# Altium schematic sheet 10B_WRAPPER.SchDoc
size 420 x 297 mm
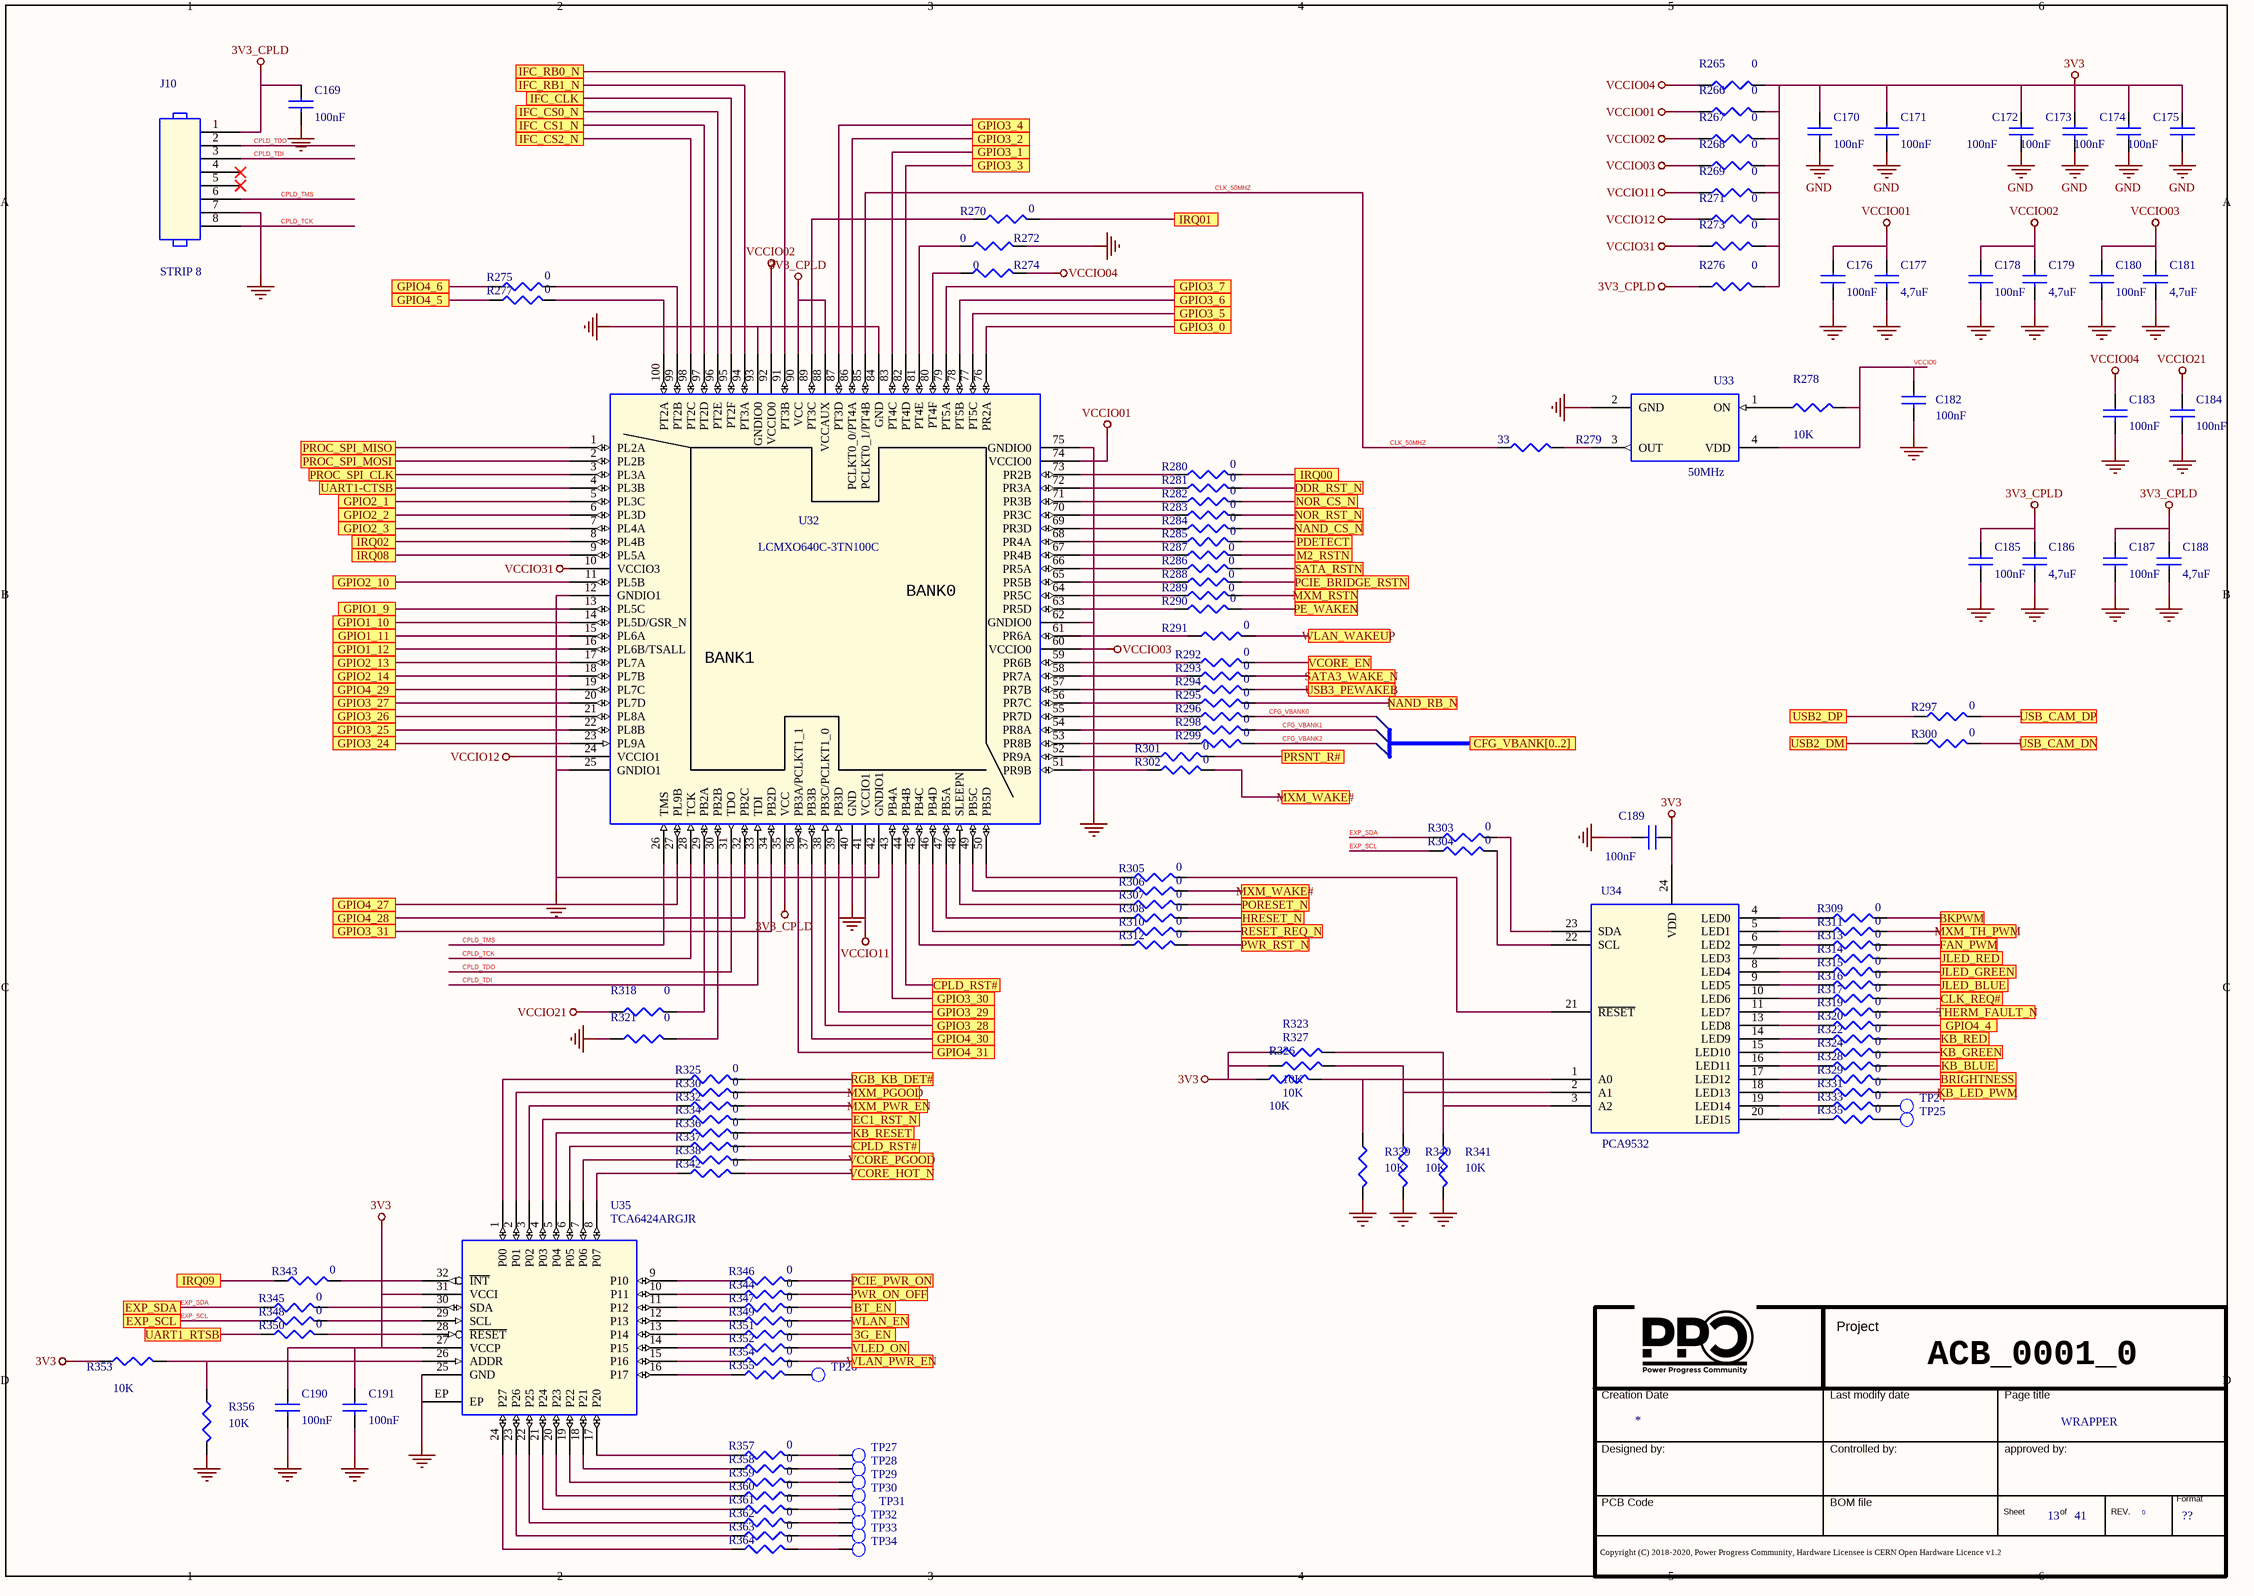
[diagram p0: 10B_WRAPPER.SchDoc]

## Parts
*  Doc: WRAPPER  Page Count: 41  Page Number: 13  Page Size: ??  RevCode: 0  (hidden comment: Title_block_PPC)  (graphical)
C169  100nF  [SMD_0402]
C170  100nF  [SMD_0402]
C171  100nF  [SMD_0402]
C172  100nF  [SMD_0402]
C173  100nF  [SMD_0402]
C174  100nF  [SMD_0402]
C175  100nF  [SMD_0402]
C176  100nF  [SMD_0402]
C177  4,7uF  [SMD_0603]
C178  100nF  [SMD_0402]
C179  4,7uF  [SMD_0603]
C180  100nF  [SMD_0402]
C181  4,7uF  [SMD_0603]
C182  100nF  [SMD_0402]
C183  100nF  [SMD_0402]
C184  100nF  [SMD_0402]
C185  100nF  [SMD_0402]
C186  4,7uF  [SMD_0603]
C187  100nF  [SMD_0402]
C188  4,7uF  [SMD_0603]
C189  100nF  [SMD_0402]
C190  100nF  [SMD_0402]
C191  100nF  [SMD_0402]
J10  STRIP 8  [PTH]
R265  0  [SMD_0402]
R266  0  [SMD_0402]
R267  0  [SMD_0402]
R268  0  [SMD_0402]
R269  0  [SMD_0402]
R270  0  [SMD_0402]
R271  0  [SMD_0402]
R272  0  [SMD_0402]
R273  0  [SMD_0402]
R274  0  [SMD_0402]
R275  0  [SMD_0402]
R276  0  [SMD_0402]
R277  0  [SMD_0402]
R278  10K  [SMD_0402]
R279  33  [SMD_0402]
R280  0  [SMD_0402]
R281  0  [SMD_0402]
R282  0  [SMD_0402]
R283  0  [SMD_0402]
R284  0  [SMD_0402]
R285  0  [SMD_0402]
R286  0  [SMD_0402]
R287  0  [SMD_0402]
R288  0  [SMD_0402]
R289  0  [SMD_0402]
R290  0  [SMD_0402]
R291  0  [SMD_0402]
R292  0  [SMD_0402]
R293  0  [SMD_0402]
R294  0  [SMD_0402]
R295  0  [SMD_0402]
R296  0  [SMD_0402]
R297  0  [SMD_0402]
R298  0  [SMD_0402]
R299  0  [SMD_0402]
R300  0  [SMD_0402]
R301  0  [SMD_0402]
R302  0  [SMD_0402]
R303  0  [SMD_0402]
R304  0  [SMD_0402]
R305  0  [SMD_0402]
R306  0  [SMD_0402]
R307  0  [SMD_0402]
R308  0  [SMD_0402]
R309  0  [SMD_0402]
R310  0  [SMD_0402]
R311  0  [SMD_0402]
R312  0  [SMD_0402]
R313  0  [SMD_0402]
R314  0  [SMD_0402]
R315  0  [SMD_0402]
R316  0  [SMD_0402]
R317  0  [SMD_0402]
R318  0  [SMD_0402]
R319  0  [SMD_0402]
R320  0  [SMD_0402]
R321  0  [SMD_0402]
R322  0  [SMD_0402]
R323  10K  [SMD_0402]
R324  0  [SMD_0402]
R325  0  [SMD_0402]
R326  10K  [SMD_0402]
R327  10K  [SMD_0402]
R328  0  [SMD_0402]
R329  0  [SMD_0402]
R330  0  [SMD_0402]
R331  0  [SMD_0402]
R332  0  [SMD_0402]
R333  0  [SMD_0402]
R334  0  [SMD_0402]
R335  0  [SMD_0402]
R336  0  [SMD_0402]
R337  0  [SMD_0402]
R338  0  [SMD_0402]
R339  10K  [SMD_0402]
R340  10K  [SMD_0402]
R341  10K  [SMD_0402]
R342  0  [SMD_0402]
R343  0  [SMD_0402]
R344  0  [SMD_0402]
R345  0  [SMD_0402]
R346  0  [SMD_0402]
R347  0  [SMD_0402]
R348  0  [SMD_0402]
R349  0  [SMD_0402]
R350  0  [SMD_0402]
R351  0  [SMD_0402]
R352  0  [SMD_0402]
R353  10K  [SMD_0402]
R354  0  [SMD_0402]
R355  0  [SMD_0402]
R356  10K  [SMD_0402]
R357  0  [SMD_0402]
R358  0  [SMD_0402]
R359  0  [SMD_0402]
R360  0  [SMD_0402]
R361  0  [SMD_0402]
R362  0  [SMD_0402]
R363  0  [SMD_0402]
R364  0  [SMD_0402]
TP24  TEST POINT  [PCB]  (value not drawn)
TP25  TEST POINT  [PCB]  (value not drawn)
TP26  TEST POINT  [PCB]  (value not drawn)
TP27  TEST POINT  [PCB]  (value not drawn)
TP28  TEST POINT  [PCB]  (value not drawn)
TP29  TEST POINT  [PCB]  (value not drawn)
TP30  TEST POINT  [PCB]  (value not drawn)
TP31  TEST POINT  [PCB]  (value not drawn)
TP32  TEST POINT  [PCB]  (value not drawn)
TP33  TEST POINT  [PCB]  (value not drawn)
TP34  TEST POINT  [PCB]  (value not drawn)
U32  LCMXO640C-3TN100C  [TQFP-100]
U33  50MHz  [4 PIN SMT]
U34  PCA9532  [TSSOP24]
U35  TCA6424ARGJR  [QFN32]

## Ports
3G_EN, BKPWM, BRIGHTNESS, BT_EN, CFG_VBANK[0..2], CLK_REQ#, CPLD_RST#, DDR_RST_N, EC1_RST_N, EXP_SCL, EXP_SDA, FAN_PWM, GPIO1_9, GPIO1_10, GPIO1_11, GPIO1_12, GPIO2_1, GPIO2_2, GPIO2_3, GPIO2_10, GPIO2_13, GPIO2_14, GPIO3_0, GPIO3_1, GPIO3_2, GPIO3_3, GPIO3_4, GPIO3_5, GPIO3_6, GPIO3_7, GPIO3_24, GPIO3_25, GPIO3_26, GPIO3_27, GPIO3_28, GPIO3_29, GPIO3_30, GPIO3_31, GPIO4_4, GPIO4_5, GPIO4_6, GPIO4_27, GPIO4_28, GPIO4_29, GPIO4_30, GPIO4_31, HRESET_N, IFC_CLK, IFC_CS0_N, IFC_CS1_N, IFC_CS2_N, IFC_RB0_N, IFC_RB1_N, IRQ00, IRQ01, IRQ02, IRQ08, IRQ09, JLED_BLUE, JLED_GREEN, JLED_RED, KB_BLUE, KB_GREEN, KB_LED_PWM, KB_RED, KB_RESET, M2_RSTN, MXM_PGOOD, MXM_PWR_EN, MXM_RSTN, MXM_TH_PWM, MXM_WAKE#, NAND_CS_N, NAND_RB_N, NOR_CS_N, NOR_RST_N, PCIE_BRIDGE_RSTN, PCIE_PWR_ON, PDETECT, PE_WAKEN, PORESET_N, PROC_SPI_CLK, PROC_SPI_MISO, PROC_SPI_MOSI, PRSNT_R#, PWR_ON_OFF, PWR_RST_N, RESET_REQ_N, RGB_KB_DET#, SATA3_WAKE_N, SATA_RSTN, THERM_FAULT_N, UART1-CTSB, UART1_RTSB, USB2_DM, USB2_DP, USB3_PEWAKEB, USB_CAM_DN, USB_CAM_DP, VCORE_EN, VCORE_HOT_N, VCORE_PGOOD, VLED_ON, WLAN_EN, WLAN_PWR_EN, WLAN_WAKEUP

## Nets
3V3: C170.1 C171.1 C172.1 C173.1 C174.1 C175.1 C189.1 C190.1 C191.1 R265.2 R266.2 R267.2 R268.2 R269.2 R271.2 R273.2 R276.2 R323.1 R326.1 R327.1 R353.1 U34.24(VDD) U35.27(VCCP) U35.31(VCCI)
3V3_CPLD: C169.1 C185.1 C186.1 C187.1 C188.1 J10.1 R276.1 U32.35(VCC) U32.88(VCCAUX) U32.90(VCC)
GND: C170.2 C171.2 C172.2 C173.2 C174.2 C175.2 C182.2 C189.2 C190.2 C191.2 R339.2 R340.2 R341.2 R356.2 U33.2(GND) U35.25(GND) U35.EP
GND_SIGNAL: C169.2 C176.2 C177.2 C178.2 C179.2 C180.2 C181.2 C183.2 C184.2 C185.2 C186.2 C187.2 C188.2 J10.7 R272.1 R321.1 U32.12(GNDIO1) U32.25(GNDIO1) U32.40(GND) U32.42(GNDIO1) U32.62(GNDIO0) U32.75(GNDIO0) U32.84(GND) U32.93(GNDIO0)
VCCIO01: C176.1 C177.1 R266.1 U32.74(VCCIO0)
VCCIO02: C178.1 C179.1 R267.1 U32.92(VCCIO0)
VCCIO03: C180.1 C181.1 R268.1 U32.60(VCCIO0)
VCCIO04: C183.1 R265.1 R274.1
VCCIO11: R269.1 U32.41(VCCIO1)
VCCIO12: R271.1 U32.24(VCCIO1)
VCCIO21: C184.1 R318.1
VCCIO31: R273.1 U32.10(VCCIO3)
3G_EN: R351.2 ; port 3G_EN
BKPWM: R309.2 ; port BKPWM
BRIGHTNESS: R329.2 ; port BRIGHTNESS
BT_EN: R347.2 ; port BT_EN
CFG_VBANK0: R296.2
CFG_VBANK1: R298.2
CFG_VBANK2: R299.2
CLK_50MHZ: R279.2 U32.85(PCLKT0_1/PT4B)
CLK_REQ#: R317.2 ; port CLK_REQ#
CPLD_RST#: R337.2 U32.44(PB4B) ; port CPLD_RST#
CPLD_TCK: J10.8 U32.28(TCK)
CPLD_TDI: J10.3 U32.33(TDI)
CPLD_TDO: J10.2 U32.31(TDO)
CPLD_TMS: J10.6 U32.26(TMS)
DDR_RST_N: R281.2 ; port DDR_RST_N
EC1_RST_N: R334.2 ; port EC1_RST_N
EXP_SCL: R304.1 R348.1 ; port EXP_SCL
EXP_SDA: R303.1 R345.1 ; port EXP_SDA
FAN_PWM: R313.2 ; port FAN_PWM
GPIO1_9: U32.13(PL5C) ; port GPIO1_9
GPIO1_10: U32.14(PL5D/GSR_N) ; port GPIO1_10
GPIO1_11: U32.15(PL6A) ; port GPIO1_11
GPIO1_12: U32.16(PL6B/TSALL) ; port GPIO1_12
GPIO2_1: U32.5(PL3C) ; port GPIO2_1
GPIO2_2: U32.6(PL3D) ; port GPIO2_2
GPIO2_3: U32.7(PL4A) ; port GPIO2_3
GPIO2_10: U32.11(PL5B) ; port GPIO2_10
GPIO2_13: U32.17(PL7A) ; port GPIO2_13
GPIO2_14: U32.18(PL7B) ; port GPIO2_14
GPIO3_0: U32.76(PR2A) ; port GPIO3_0
GPIO3_1: U32.83(PT4C) ; port GPIO3_1
GPIO3_2: U32.86(PCLKT0_0/PT4A) ; port GPIO3_2
GPIO3_3: U32.82(PT4D) ; port GPIO3_3
GPIO3_4: U32.87(PT3D) ; port GPIO3_4
GPIO3_5: U32.77(PT5C) ; port GPIO3_5
GPIO3_6: U32.78(PT5B) ; port GPIO3_6
GPIO3_7: U32.79(PT5A) ; port GPIO3_7
GPIO3_24: U32.23(PL9A) ; port GPIO3_24
GPIO3_25: U32.22(PL8B) ; port GPIO3_25
GPIO3_26: U32.21(PL8A) ; port GPIO3_26
GPIO3_27: U32.20(PL7D) ; port GPIO3_27
GPIO3_28: U32.38(PB3C/PCLKT1_0) ; port GPIO3_28
GPIO3_29: U32.39(PB3D) ; port GPIO3_29
GPIO3_30: U32.43(PB4A) ; port GPIO3_30
GPIO3_31: U32.34(PB2D) ; port GPIO3_31
GPIO4_4: R320.2 ; port GPIO4_4
GPIO4_5: R277.1 ; port GPIO4_5
GPIO4_6: R275.1 ; port GPIO4_6
GPIO4_27: U32.27(PL9B) ; port GPIO4_27
GPIO4_28: U32.32(PB2C) ; port GPIO4_28
GPIO4_29: U32.19(PL7C) ; port GPIO4_29
GPIO4_30: U32.37(PB3B) ; port GPIO4_30
GPIO4_31: U32.36(PB3A/PCLKT1_1) ; port GPIO4_31
HRESET_N: R308.2 ; port HRESET_N
IFC_CLK: U32.95(PT2F) ; port IFC_CLK
IFC_CS0_N: U32.96(PT2E) ; port IFC_CS0_N
IFC_CS1_N: U32.97(PT2D) ; port IFC_CS1_N
IFC_CS2_N: U32.98(PT2C) ; port IFC_CS2_N
IFC_RB0_N: U32.91(PT3B) ; port IFC_RB0_N
IFC_RB1_N: U32.94(PT3A) ; port IFC_RB1_N
IRQ00: R280.2 ; port IRQ00
IRQ01: R270.2 ; port IRQ01
IRQ02: U32.8(PL4B) ; port IRQ02
IRQ08: U32.9(PL5A) ; port IRQ08
IRQ09: R343.1 ; port IRQ09
JLED_BLUE: R316.2 ; port JLED_BLUE
JLED_GREEN: R315.2 ; port JLED_GREEN
JLED_RED: R314.2 ; port JLED_RED
KB_BLUE: R328.2 ; port KB_BLUE
KB_GREEN: R324.2 ; port KB_GREEN
KB_LED_PWM: R331.2 ; port KB_LED_PWM
KB_RED: R322.2 ; port KB_RED
KB_RESET: R336.2 ; port KB_RESET
M2_RSTN: R287.2 ; port M2_RSTN
MXM_PGOOD: R330.2 ; port MXM_PGOOD
MXM_PWR_EN: R332.2 ; port MXM_PWR_EN
MXM_RSTN: R289.2 ; port MXM_RSTN
MXM_TH_PWM: R311.2 ; port MXM_TH_PWM
MXM_WAKE#: R302.2 R306.2 ; port MXM_WAKE#
NAND_CS_N: R284.2 ; port NAND_CS_N
NAND_RB_N: R295.2 ; port NAND_RB_N
NOR_CS_N: R282.2 ; port NOR_CS_N
NOR_RST_N: R283.2 ; port NOR_RST_N
PCIE_BRIDGE_RSTN: R288.2 ; port PCIE_BRIDGE_RSTN
PCIE_PWR_ON: R346.2 ; port PCIE_PWR_ON
PDETECT: R285.2 ; port PDETECT
PE_WAKEN: R290.2 ; port PE_WAKEN
PORESET_N: R307.2 ; port PORESET_N
PROC_SPI_CLK: U32.3(PL3A) ; port PROC_SPI_CLK
PROC_SPI_MISO: U32.1(PL2A) ; port PROC_SPI_MISO
PROC_SPI_MOSI: U32.2(PL2B) ; port PROC_SPI_MOSI
PRSNT_R#: R301.2 ; port PRSNT_R#
PWR_ON_OFF: R344.2 ; port PWR_ON_OFF
PWR_RST_N: R312.2 ; port PWR_RST_N
RESET_REQ_N: R310.2 ; port RESET_REQ_N
RGB_KB_DET#: R325.2 ; port RGB_KB_DET#
SATA3_WAKE_N: R293.2 ; port SATA3_WAKE_N
SATA_RSTN: R286.2 ; port SATA_RSTN
THERM_FAULT_N: R319.2 ; port THERM_FAULT_N
UART1-CTSB: U32.4(PL3B) ; port UART1-CTSB
UART1_RTSB: R350.1 ; port UART1_RTSB
USB2_DM: R300.1 ; port USB2_DM
USB2_DP: R297.1 ; port USB2_DP
USB3_PEWAKEB: R294.2 ; port USB3_PEWAKEB
USB_CAM_DN: R300.2 ; port USB_CAM_DN
USB_CAM_DP: R297.2 ; port USB_CAM_DP
VCCIO0: C182.1 R278.1 U33.4(VDD)
VCORE_EN: R292.2 ; port VCORE_EN
VCORE_HOT_N: R342.2 ; port VCORE_HOT_N
VCORE_PGOOD: R338.2 ; port VCORE_PGOOD
VLED_ON: R352.2 ; port VLED_ON
WLAN_EN: R349.2 ; port WLAN_EN
WLAN_PWR_EN: R354.2 ; port WLAN_PWR_EN
WLAN_WAKEUP: R291.2 ; port WLAN_WAKEUP
NetR270_1: R270.1 U32.89(PT3C)
NetR272_2: R272.2 U32.81(PT4E)
NetR274_2: R274.2 U32.80(PT4F)
NetR275_2: R275.2 U32.99(PT2B)
NetR277_2: R277.2 U32.100(PT2A)
NetR278_2: R278.2 U33.1(ON)
NetR279_1: R279.1 U33.3(OUT)
NetR280_1: R280.1 U32.73(PR2B)
NetR281_1: R281.1 U32.72(PR3A)
NetR282_1: R282.1 U32.71(PR3B)
NetR283_1: R283.1 U32.70(PR3C)
NetR284_1: R284.1 U32.69(PR3D)
NetR285_1: R285.1 U32.68(PR4A)
NetR286_1: R286.1 U32.66(PR5A)
NetR287_1: R287.1 U32.67(PR4B)
NetR288_1: R288.1 U32.65(PR5B)
NetR289_1: R289.1 U32.64(PR5C)
NetR290_1: R290.1 U32.63(PR5D)
NetR291_1: R291.1 U32.61(PR6A)
NetR292_1: R292.1 U32.59(PR6B)
NetR293_1: R293.1 U32.58(PR7A)
NetR294_1: R294.1 U32.57(PR7B)
NetR295_1: R295.1 U32.56(PR7C)
NetR296_1: R296.1 U32.55(PR7D)
NetR298_1: R298.1 U32.54(PR8A)
NetR299_1: R299.1 U32.53(PR8B)
NetR301_1: R301.1 U32.52(PR9A)
NetR302_1: R302.1 U32.51(PR9B)
NetR303_2: R303.2 U34.23(SDA)
NetR304_2: R304.2 U34.22(SCL)
NetR305_1: R305.1 U32.50(PB5D)
NetR305_2: R305.2 U34.21(~{RESET})
NetR306_1: R306.1 U32.49(PB5C)
NetR307_1: R307.1 U32.48(SLEEPN)
NetR308_1: R308.1 U32.47(PB5A)
NetR309_1: R309.1 U34.4(LED0)
NetR310_1: R310.1 U32.46(PB4D)
NetR311_1: R311.1 U34.5(LED1)
NetR312_1: R312.1 U32.45(PB4C)
NetR313_1: R313.1 U34.6(LED2)
NetR314_1: R314.1 U34.7(LED3)
NetR315_1: R315.1 U34.8(LED4)
NetR316_1: R316.1 U34.9(LED5)
NetR317_1: R317.1 U34.10(LED6)
NetR318_2: R318.2 U32.29(PB2A)
NetR319_1: R319.1 U34.11(LED7)
NetR320_1: R320.1 U34.13(LED8)
NetR321_2: R321.2 U32.30(PB2B)
NetR322_1: R322.1 U34.14(LED9)
NetR323_2: R323.2 R341.1 U34.3(A2)
NetR324_1: R324.1 U34.15(LED10)
NetR325_1: R325.1 U35.1(P00)
NetR326_2: R326.2 R339.1 U34.1(A0)
NetR327_2: R327.2 R340.1 U34.2(A1)
NetR328_1: R328.1 U34.16(LED11)
NetR329_1: R329.1 U34.17(LED12)
NetR330_1: R330.1 U35.2(P01)
NetR331_1: R331.1 U34.18(LED13)
NetR332_1: R332.1 U35.3(P02)
NetR333_1: R333.1 U34.19(LED14)
NetR333_2: R333.2 TP24.1(TP)
NetR334_1: R334.1 U35.4(P03)
NetR335_1: R335.1 U34.20(LED15)
NetR335_2: R335.2 TP25.1(TP)
NetR336_1: R336.1 U35.5(P04)
NetR337_1: R337.1 U35.6(P05)
NetR338_1: R338.1 U35.7(P06)
NetR342_1: R342.1 U35.8(P07)
NetR343_2: R343.2 U35.32(~{INT})
NetR344_1: R344.1 U35.10(P11)
NetR345_2: R345.2 U35.30(SDA)
NetR346_1: R346.1 U35.9(P10)
NetR347_1: R347.1 U35.11(P12)
NetR348_2: R348.2 U35.29(SCL)
NetR349_1: R349.1 U35.12(P13)
NetR350_2: R350.2 U35.28(~{RESET})
NetR351_1: R351.1 U35.13(P14)
NetR352_1: R352.1 U35.14(P15)
NetR353_2: R353.2 R356.1 U35.26(ADDR)
NetR354_1: R354.1 U35.15(P16)
NetR355_1: R355.1 U35.16(P17)
NetR355_2: R355.2 TP26.1(TP)
NetR357_1: R357.1 U35.17(P20)
NetR357_2: R357.2 TP27.1(TP)
NetR358_1: R358.1 U35.18(P21)
NetR358_2: R358.2 TP28.1(TP)
NetR359_1: R359.1 U35.19(P22)
NetR359_2: R359.2 TP29.1(TP)
NetR360_1: R360.1 U35.20(P23)
NetR360_2: R360.2 TP30.1(TP)
NetR361_1: R361.1 U35.21(P24)
NetR361_2: R361.2 TP31.1(TP)
NetR362_1: R362.1 U35.22(P25)
NetR362_2: R362.2 TP32.1(TP)
NetR363_1: R363.1 U35.23(P26)
NetR363_2: R363.2 TP33.1(TP)
NetR364_1: R364.1 U35.24(P27)
NetR364_2: R364.2 TP34.1(TP)

Not connected (* = marked no-connect by the designer): J10 4* 5*

## Notes on the sheet
- (near U32) BANK0
- (near U32) BANK1
- ACB_0001_0
- (in symbol Title_block_PPC) Project; Creation Date; Last modify date; Page title; Designed by:; Controlled by:; approved by:; Format; PCB Code; BOM file; Sheet; of; REV.; Copyright (C) 2018-2020, Power Progress Community, Hardware Licensee is CERN Open Hardware Licence v1.2

## Library data of the parts
* = Title_block_PPC: Title: T2080PCIe; Schematic Page Count: 45; Schematic Page Number: 15; Author: MICETEK; Page Create Date: March  8, 1995; Page Title: ?; Page Modify Date: *
C169-C173 C178 C180 C189-C191 = CAP NP_Dup3: COND.CER. 100NF 50V 0402 X7R SMD; Manufacturer Part Number 1: CGA2B3X7R1H104M050BD; Manufacturer 1: TDK; Part Number: PASSIVE_24; RSM: RC0402; Distributor 1: MURATA ELETTRONICA SPA; Part Type: Capacitors\Ceramic\SMD\0402; PCB Footprint: SMD_0402
C174-C176 C183-C185 C187 = CAP NP_Dup3: COND.CER. 100NF 50V 0402 X7R SMD; Part Number: PASSIVE_24; Manufacturer 1: TDK; Manufacturer Part Number 1: CGA2B3X7R1H104M050BD; RSM: RC0402; Part Type: Capacitors\Ceramic\SMD\0402; Distributor 1: MURATA ELETTRONICA SPA; PCB Footprint: SMD_0402
C177 C186 C188 = CAP NP_Dup3: COND.CER.4,7uF 16V X5R 0603 SMD; Part Number: PASSIVE_1405; Manufacturer 1: SAMSUNG; Manufacturer Part Number 1: CL10A475KO8NNNC; RSM: RC0603; Part Type: Capacitors\Ceramic\SMD\0603; Distributor 1: DIGIKEY (445-8023-1-ND); PCB Footprint: SMD_0603
C179 C181 = CAP NP_Dup3: COND.CER.4,7uF 16V X5R 0603 SMD; Manufacturer Part Number 1: CL10A475KO8NNNC; Manufacturer 1: SAMSUNG; Part Number: PASSIVE_1405; RSM: RC0603; Distributor 1: DIGIKEY (445-8023-1-ND); Part Type: Capacitors\Ceramic\SMD\0603; PCB Footprint: SMD_0603
C182 = CAP NP_Dup4: COND.CER. 100NF 50V 0402 X7R SMD; Manufacturer Part Number 1: CGA2B3X7R1H104M050BD; Manufacturer 1: TDK; Part Number: PASSIVE_24; LNK_PART: C0402; RSM: RC0402; Distributor 1: MURATA ELETTRONICA SPA; Part Type: Capacitors\Ceramic\SMD\0402; PCB Footprint: SMD_0402
J10 = HEADER_8: STRIP MASC.1x8P CS.p=2.54mm; Manufacturer Part Number 1: TSW-108-24-T-S; Manufacturer 1: Samtec; Part Number: CONNECTORS_464; RSM: PIN-100MLS-8; PCB Footprint: PTH; Distributor 1: CLAITRON LASI SILVESTAR S.R.L.; Part Type: Strip\Terminal
R265-R269 R271 R273 R286-R289 R318 = R_Dup4: RESIS.CHIP 0R 5% 0402 SMD; Part Number: PASSIVE_805; Manufacturer 1: ROYAL OHM; RSM: RC0402; Part Type: Resistors\Fixed\SMD\0402\5%; Manufacturer Part Number 1: RESIS.CHIP 0R 5% 0402 SMD; Distributor 1: CAMEL ELETTRONICA SRL  #; PCB Footprint: SMD_0402
R270 R280-R285 R291-R299 R301 R302 R305-R317 R319 R320 R322 R324 R325 R328-R338 R342 R350 = R_Dup5: RESIS.CHIP 0R 5% 0402 SMD; Part Number: PASSIVE_805; Manufacturer 1: ROYAL OHM; RSM: RC0402; PCB Footprint: SMD_0402; Part Type: Resistors\Fixed\SMD\0402\5%; Manufacturer Part Number 1: RESIS.CHIP 0R 5% 0402 SMD; Distributor 1: CAMEL ELETTRONICA SRL  #
R272 R274 R276 R321 = R_Dup4: RESIS.CHIP 0R 5% 0402 SMD; Manufacturer 1: ROYAL OHM; Part Number: PASSIVE_805; RSM: RC0402; Distributor 1: CAMEL ELETTRONICA SRL  #; Manufacturer Part Number 1: RESIS.CHIP 0R 5% 0402 SMD; Part Type: Resistors\Fixed\SMD\0402\5%; PCB Footprint: SMD_0402
R275 R277 R290 R300 R303 R304 R343-R349 R351 R352 R354 R355 R357-R364 = R_Dup5: RESIS.CHIP 0R 5% 0402 SMD; Manufacturer 1: ROYAL OHM; Part Number: PASSIVE_805; RSM: RC0402; Distributor 1: CAMEL ELETTRONICA SRL  #; Manufacturer Part Number 1: RESIS.CHIP 0R 5% 0402 SMD; Part Type: Resistors\Fixed\SMD\0402\5%; PCB Footprint: SMD_0402
R278 R323 R326 R327 R339-R341 R356 = R_Dup5: RESIS.CHIP 10K 1% 0402 SMD; Part Number: PASSIVE_584; Manufacturer 1: ROYAL OHM; RSM: RC0402; Part Type: Resistors\Fixed\SMD\0402\1%; PCB Footprint: SMD_0402; Manufacturer Part Number 1: RESIS.CHIP 10K 1% 0402 SMD
R279 = R_Dup4: RESIS.CHIP 33R 5% 0402 SMD; Part Number: PASSIVE_853; Manufacturer 1: ROYAL OHM; RSM: RC0402; Part Type: Resistors\Fixed\SMD\0402\5%; Manufacturer Part Number 1: RESIS.CHIP 33R 5% 0402 SMD; Distributor 1: CAMEL ELETTRONICA SRL  #; PCB Footprint: SMD_0402
R353 = R_Dup5: RESIS.CHIP 10K 1% 0402 SMD; Manufacturer 1: ROYAL OHM; Part Number: PASSIVE_584; RSM: RC0402; Manufacturer Part Number 1: RESIS.CHIP 10K 1% 0402 SMD; Part Type: Resistors\Fixed\SMD\0402\1%; PCB Footprint: SMD_0402
TP24-TP34 = T POINT R: TEST POINT SU PCB; Part Number: CONNECTORS_542; RSM: AE-TESTPOINT; PCB Footprint: PCB; Part Type: Tpoint
U32 = LCMXO256: CPLD 640 LUTS 74 I/O 100 TQFP; Part Number: LOGIC_349; Manufacturer 1: LATTICE; Manufacturer Part Number 1: LCMXO640C-3TN100C / LCMXO256C-3TN100C; PCB Footprint: 100-LQFP; RSM: LQFP-100; Part Type: CPLD; Distributor 1: MOUSER(842-MXO640C3TN100C)
U33 = OSCILLATOR_Dup1: Oscillator 50Mhz SMD 3.2x2.5mm 4 Pads 1.8V; Manufacturer Part Number 1: ASE3-50.000MHZ-KT; Manufacturer 1: ABRACOM; Part Number: MISC_104; PCB Footprint: SMD_3.2x2.5; RSM: XC-CTS-632; Distributor 1: DIGIKEY(535-9554-1-ND); Part Type: Oscillator
U34 = PCA9532_0: LED DRIVER, PWM, 400KHZ, TSSOP-24; Part Number: LOGIC_114; Manufacturer 1: NXP; Manufacturer Part Number 1: PCA9532PW,112; PCB Footprint: 24-TSSOP; Part Type: I2C\EXPANDERS; Distributor 1: FARNELL(2400469); RSM: TSSOP-24
U35 = TCA6424A_0: I/O Expander 24 I²C, SMBus 32-UQFN; Manufacturer: TI; Manufacturer 1: TEXAS; Part Number: LOGIC_119; RSM: QFN-32-EP; Manufacturer p/n: TCA6424ARGJR; PCB Footprint: 32-UQFN; Distributor 1: DIGIKEY( 	296-27844-1-ND); Manufacturer Part Number 1: TCA6424ARGJR; Part Type: I2C\EXPANDERS